# EAGLE design pico_tracker_v3.2 (EAGLE 6.4)
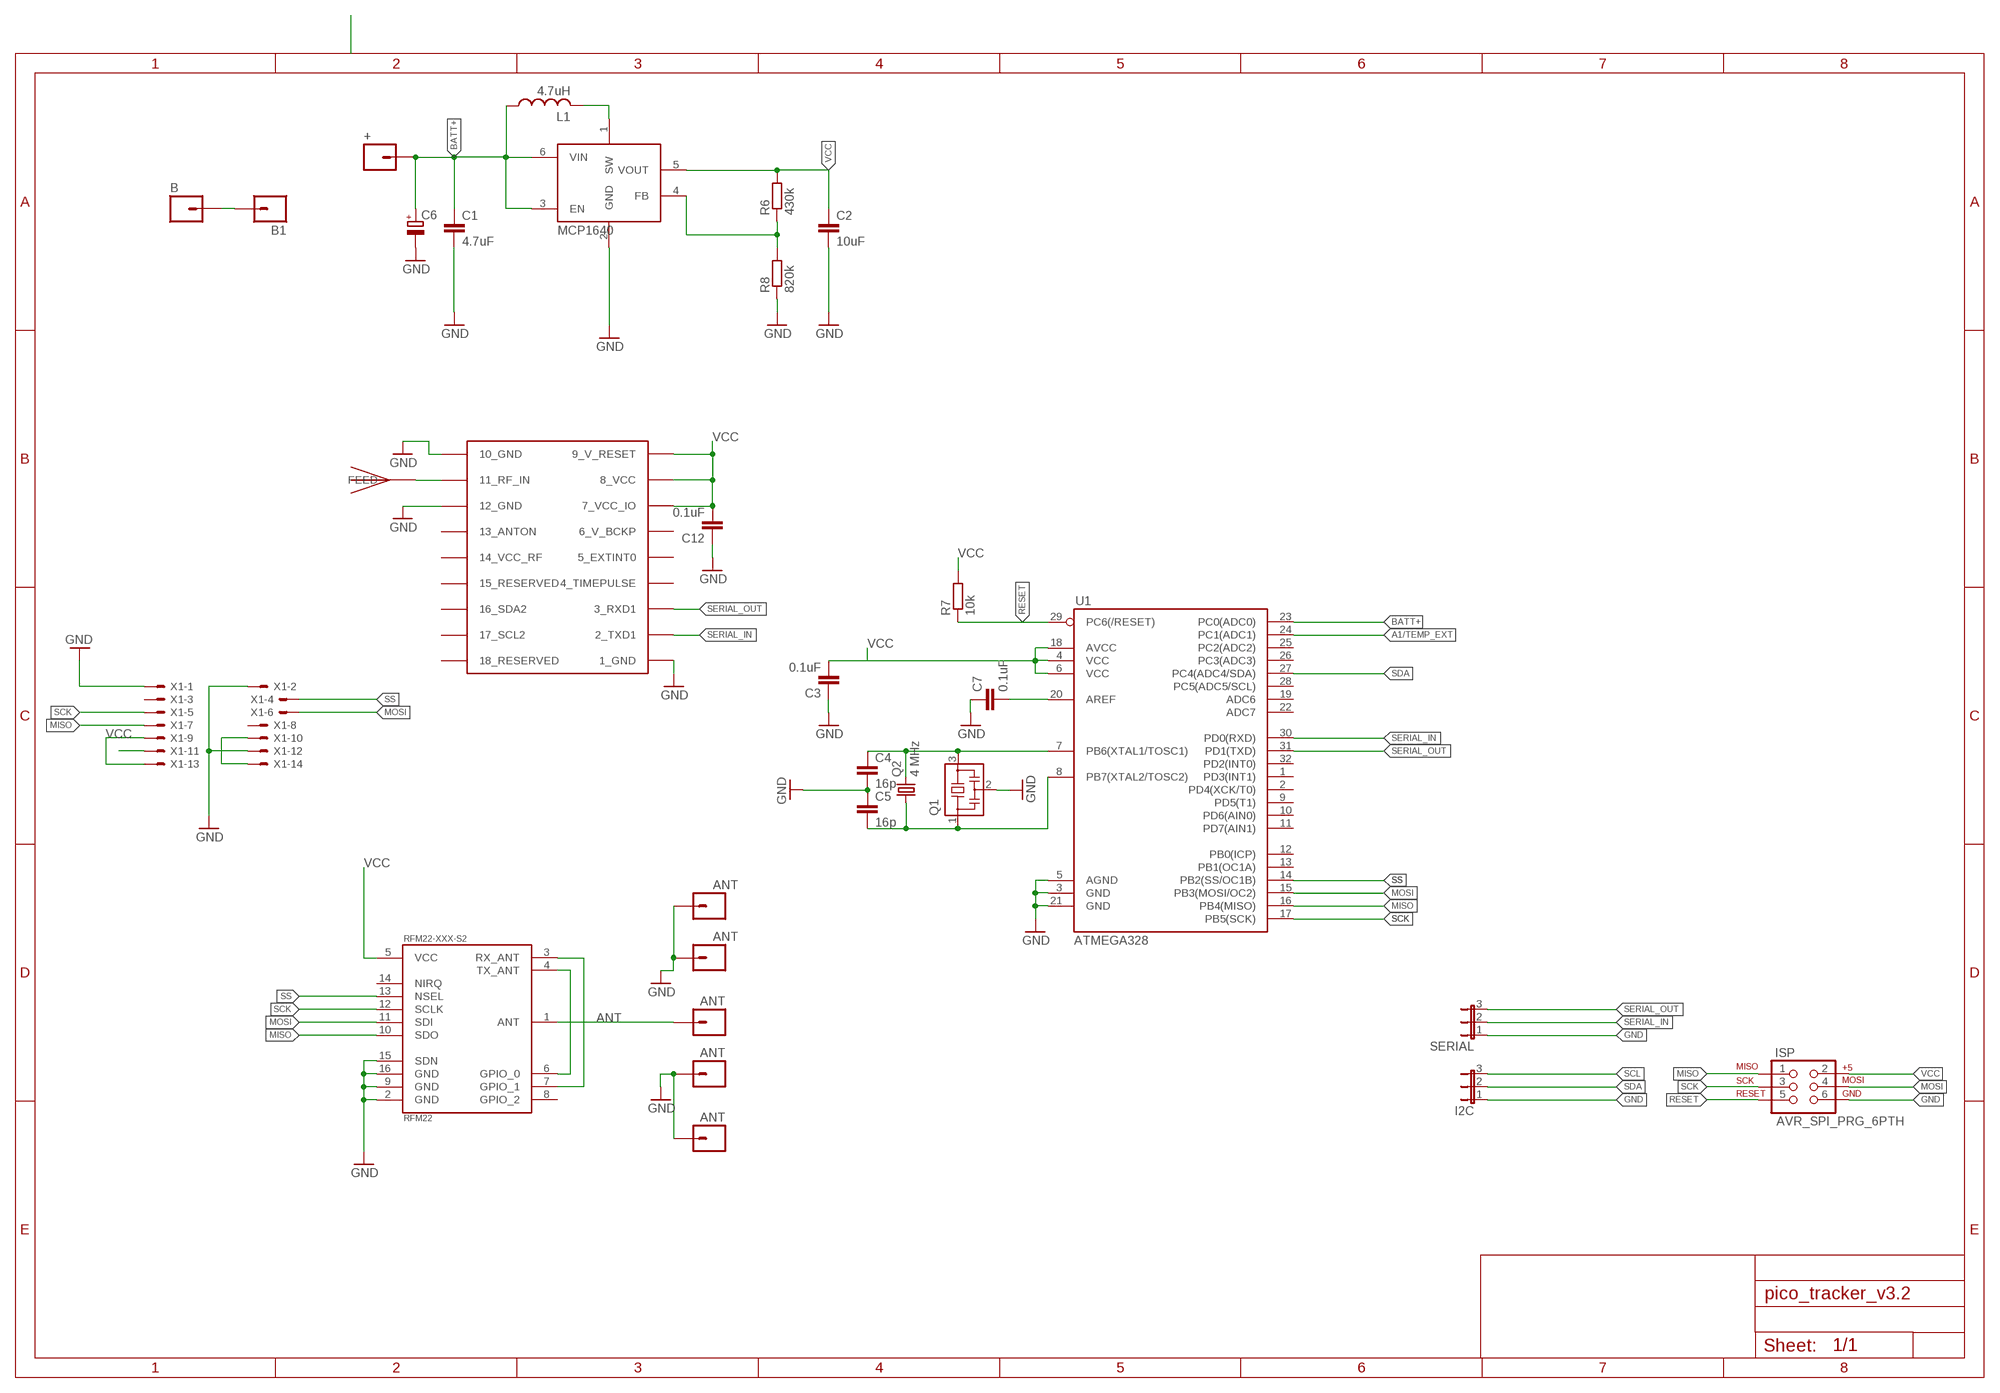
[diagram p0: schematic, sheet 1]

## Parts
+  M01PTH  [1X01]
B  M01PTH  [1X01]
B1  M01PTH  [1X01]
C1  4.7uF  C-EUC0805  [C0805]
C2  10uF  C-EUC0805  [C0805]
C3  0.1uF  C-EUC0603  [C0603]
C4  16p  C-EUC0603  [C0603]
C5  16p  C-EUC0603  [C0603]
C6  CPOL-EUSMCD  [SMC_D]
C7  0.1uF  C-EUC0603  [C0603]
C12  0.1uF  C-EUC0603  [C0603]
GND  ANT  M01PTH  [1X01]
GND17  ANT  M01PTH  [1X01]
GPS_ANT  JTI_ANTENNA-1575AT43A40  [JTI_ANTENNA-1575AT43A40]
I2C  JP2E  [JP2]
ISP  AVR_SPI_PRG_6PTH  [2X3]
JP2  ANT  M01PTH  [1X01]
JP3  ANT  M01PTH  [1X01]
JP4  ANT  M01PTH  [1X01]
L1  4.7uH  LLQH44P_P0  [LQH44]
Q1  CSTCR6M00G53Z  [CSTCR6M]
Q2  4 MHz  ABRACON_ABM3_CRYSTALABM03_HC49  [ABM03_HC49]
R6  430k  R-EU_R0603  [R0603]
R7  10k  R-EU_R0603  [R0603]
R8  820k  R-EU_R0603  [R0603]
RFM22-XXX-S2  RFM22  [RFM22-XXX-S2]
SERIAL  JP2E  [JP2]
U1  ATMEGA328  ATMEGA168  [TQFP32-08]
U2  MCP1640  [SOT23-6]
U$3  UBLOX_MAX-6  [UBLOX_MAX-6]
X1  87758-1416  [87758-1416]

## Nets
A1/TEMP_EXT: U1.24(PC1(ADC1))
ANT: JP2.1 RFM22-XXX-S2.1(ANT)
AREF: C7.2 U1.20(AREF)
BATT+ [vcc]: +.1 C1.1 C6.+ L1.P$1 U1.23(PC0(ADC0)) U2.3(EN) U2.6(VIN)
GND: C1.2 C2.2 C3.1 C4.2 C5.1 C6.- C7.1 C12.1 GND17.1 GND.1 I2C.1 ISP.6 JP3.1 JP4.1 Q1.2 R8.1 RFM22-XXX-S2.2(GND) RFM22-XXX-S2.9(GND) RFM22-XXX-S2.15(SDN) RFM22-XXX-S2.16(GND) SERIAL.1 U1.3(GND) U1.5(AGND) U1.21(GND) U2.2(GND) U$3.1_GND U$3.10_GND U$3.12_GND X1.1 X1.2 X1.12
GPS_ANT: GPS_ANT.FEED U$3.11_RF_IN
MISO: ISP.1 RFM22-XXX-S2.10(SDO) U1.16(PB4(MISO)) X1.7
MOSI: ISP.4 RFM22-XXX-S2.11(SDI) U1.15(PB3(MOSI/OC2)) X1.6
N$1: B1.1 B.1
N$2: X1.9 X1.13
N$3: X1.10 X1.14
N$6: RFM22-XXX-S2.4(TX_ANT) RFM22-XXX-S2.6(GPIO_0)
N$7: RFM22-XXX-S2.3(RX_ANT) RFM22-XXX-S2.7(GPIO_1)
N$8: L1.P$2 U2.1(SW)
N$9: C4.1 Q1.3 Q2.2 U1.7(PB6(XTAL1/TOSC1))
N$10: C5.2 Q1.1 Q2.1 U1.8(PB7(XTAL2/TOSC2))
N$11: R6.1 R8.2 U2.4(FB)
RESET: ISP.5 R7.1 U1.29(PC6(/RESET))
SCK: ISP.3 RFM22-XXX-S2.12(SCLK) U1.17(PB5(SCK)) X1.5
SCL: I2C.3
SDA: I2C.2 U1.27(PC4(ADC4/SDA))
SERIAL_IN: SERIAL.2 U1.30(PD0(RXD)) U$3.2_TXD1
SERIAL_OUT: SERIAL.3 U1.31(PD1(TXD)) U$3.3_RXD1
SS: RFM22-XXX-S2.13(NSEL) U1.14(PB2(SS/OC1B)) X1.4
VCC: C2.1 C3.2 C12.2 ISP.2 R6.2 R7.2 RFM22-XXX-S2.5(VCC) U1.4(VCC) U1.6(VCC) U1.18(AVCC) U2.5(VOUT) U$3.7_VCC_IO U$3.8_VCC U$3.9_V_RESET X1.11
Unconnected: RFM22-XXX-S2.8(GPIO_2) RFM22-XXX-S2.14(NIRQ) U1.1(PD3(INT1)) U1.2(PD4(XCK/T0)) U1.9(PD5(T1)) U1.10(PD6(AIN0)) U1.11(PD7(AIN1)) U1.12(PB0(ICP)) U1.13(PB1(OC1A)) U1.19(ADC6) U1.22(ADC7) U1.25(PC2(ADC2)) U1.26(PC3(ADC3)) U1.28(PC5(ADC5/SCL)) U1.32(PD2(INT0)) U$3.4_TIMEPULSE U$3.5_EXTINT0 U$3.6_V_BCKP U$3.13_ANTON U$3.14_VCC_RF U$3.15_RESERVED U$3.16_SDA2 U$3.17_SCL2 U$3.18_RESERVED X1.3 X1.8

## Library data of the parts
+ B B1 = #sparkfun:M01: Header 1 Standard 1-pin 0.1" header. Use with straight break away headers (SKU : PRT-00116), right angle break away headers (PRT-00553), swiss pins (PRT-00743), machine pins (PRT-00117), and female headers (PRT-00115).
C1-C5 C7 C12 = resistor:C-EU: CAPACITOR, European symbol
C6 = rcl:CPOL-EU: POLARIZED CAPACITOR, European symbol
GND GND17 JP2-JP4 = SparkFun:M01: Header 1 Standard 1-pin 0.1" header. Use with straight break away headers (SKU : PRT-00116), right angle break away headers (PRT-00553), swiss pins (PRT-00743), machine pins (PRT-00117), and female headers (PRT-00115).
GPS_ANT = ava:JTI_ANTENNA-1575AT43A40
I2C SERIAL = jumper:JP2E: JUMPER
ISP = SparkFun:AVR_SPI_PRG_6: AVR ISP 6 Pin This is the reduced ISP connector for AVR programming. Common on Arduino. This footprint will take up less PCB space and can be used with a 10-pin to 6-pin adapter such as SKU: BOB-08508
L1 = karlnet-parts:L
Q1 = murata-filter:CSTCR: Resonator Source: murata.co.jp; MPN: CSTCR6M00G53-R0; OC_FARNELL: 1170434; OC_NEWARK: 25M8759
Q2 = ava:ABRACON_ABM3_CRYSTAL
R6-R8 = resistor:R-EU_: RESISTOR, European symbol
RFM22-XXX-S2 = SparkFun:RFM22: *Hope RF's RFM22* Packages: RFM22-S2 (SMD)
U1 = SparkFun:ATMEGA168
U2 = karlnet-parts:MCP1640: MCP1623, 1624, 1640/B/C/D pwm/pfm or pwm only DC/DC converters, in SOT-23
U$3 = ava:UBLOX_MAX-6: UBLOX MAX-6
X1 = con-molex:87758-1416: 14 Pin - 2mm Dual Row Single Wafer, Vertical T/H HDR Source: http://www.molex.com/pdm_docs/sd/877580616_sd.pdf

## Net classes
0 default: width 0.254 mm, drill 0.508 mm, clearance 0.254 mm
1 vcc: width 0.254 mm

## Board
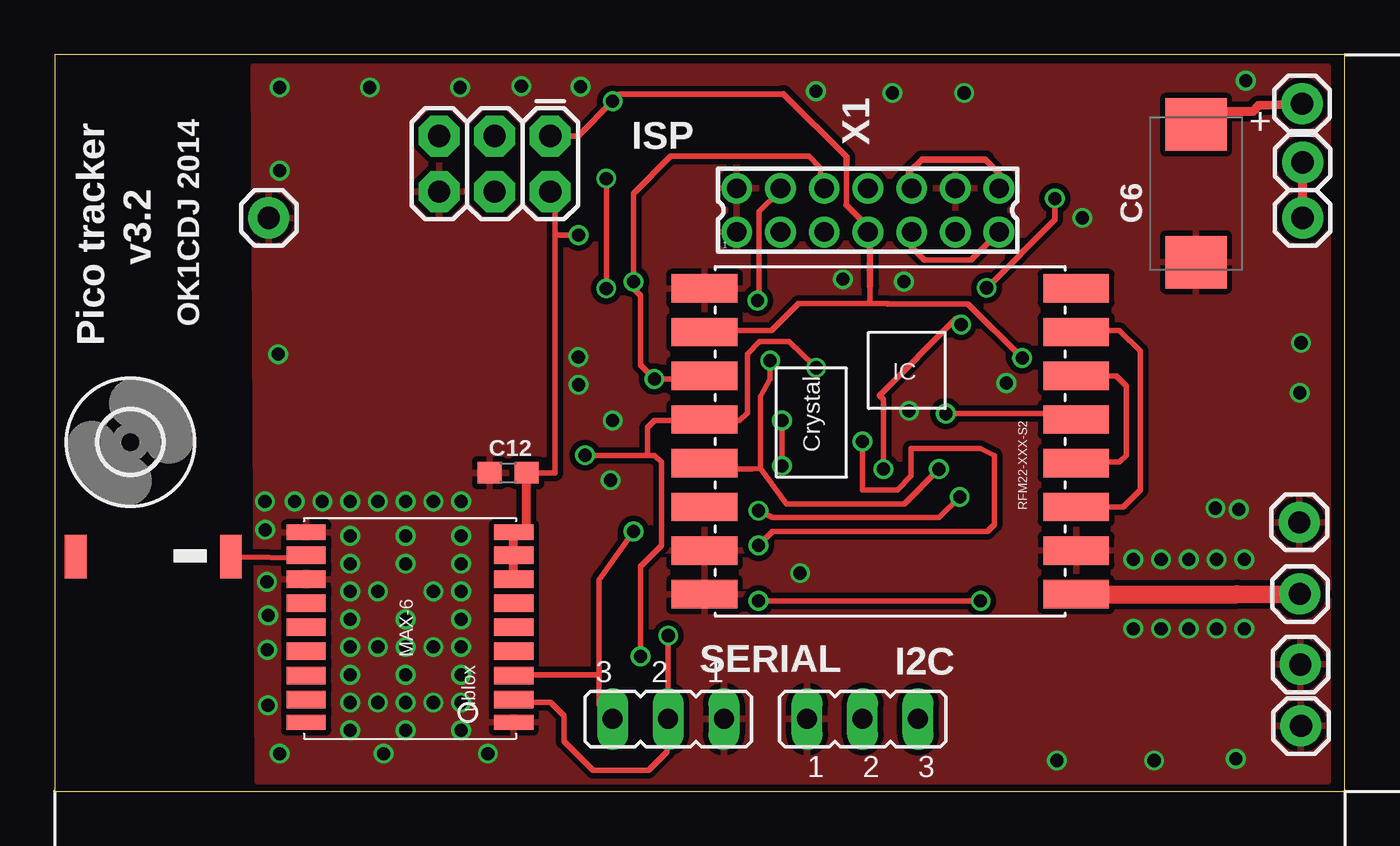
[diagram p1: board, top side]
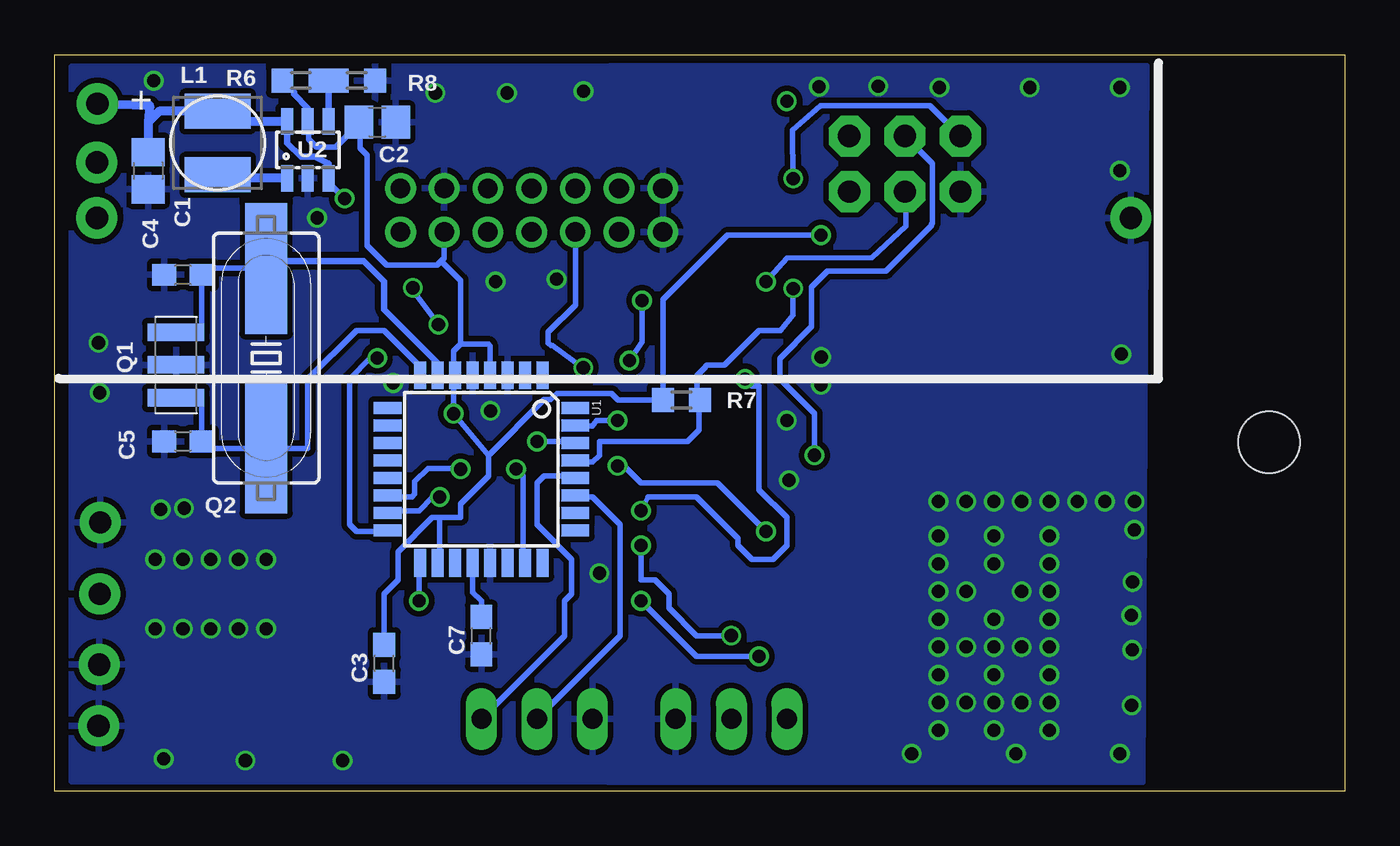
[diagram p2: board, bottom side, seen from below]

Size 59.02 x 33.7 mm. Coordinates in mm from the lower left corner, seen from the top.
Outline: 0,0 59.02,0 59.02,33.7 0,33.7 0,0
Copper layers (1*16): Top 0.035mm / dielectric 1.5mm / Bottom 0.035mm
Design rules "Fusion_eagle_rule_v1.1": minimum track width 6mil, minimum drill 12mil, track to track 6mil, track to pad 6mil, pad to pad 6mil, via to via 6mil, smd to smd 0mil, copper to edge 10mil, drill to drill 10mil, minimum pad ring 10mil, minimum via ring 6mil, stop-mask expansion 2mil, vias tented up to drill 100mil, thermal gap 10mil

### Footprints (pad centres in the part's own frame; a part is rotated, then mirrored left to right if it is on the bottom)
1X01 = drill 1.016 pad 1.88: 1 0,0
C0805 = smd 1.3 x 1.5: 1 -0.85,0; 2 0.85,0
C0603 = smd 1.1 x 1: 1 -0.85,0; 2 0.85,0
SMC_D = smd 2.4 x 2.8: + -3.15,0; - 3.15,0
JTI_ANTENNA-1575AT43A40 = smd 1 x 2: FEED -3.81,-1.27; NC 3.29,-1.27
JP2 = drill 0.914 long: 1 -2.54,0; 2 0,0; 3 2.54,0
2X3 = drill 1.016 pad 1.88 octagon: 1 0,0; 2 0,2.54; 3 2.54,0; 4 2.54,2.54; 5 5.08,0; 6 5.08,2.54
LQH44 = smd 1.6 x 3: P$1 -1.45,0; P$2 1.45,0
CSTCR6M = smd 0.8 x 2.6: 1 -1.5,0; 2 0,0; 3 1.5,0
ABM03_HC49 = smd 6 x 1.93: 1 -4.1,0; 2 4.1,0
R0603 = smd 1 x 1.1: 1 -0.85,0; 2 0.85,0
RFM22-XXX-S2 = smd 3 x 1.3: 1 -8.5,7; 2 -8.5,5; 3 -8.5,3; 4 -8.5,1; 5 -8.5,-1; 6 -8.5,-3; 7 -8.5,-5; 8 -8.5,-7; 9 8.5,-7; 10 8.5,-5; 11 8.5,-3; 12 8.5,-1; 13 8.5,1; 14 8.5,3; 15 8.5,5; 16 8.5,7
TQFP32-08 = smd 1.27 x 0.559: 1 -4.293,2.8; 2 -4.293,2; 3 -4.293,1.2; 4 -4.293,0.4; 5 -4.293,-0.4; 6 -4.293,-1.2; 7 -4.293,-2; 8 -4.293,-2.8; 17 4.293,-2.8; 18 4.293,-2; 19 4.293,-1.2; 20 4.293,-0.4; 21 4.293,0.4; 22 4.293,1.2; 23 4.293,2; 24 4.293,2.8 | smd 0.559 x 1.27: 9 -2.8,-4.293; 10 -2,-4.293; 11 -1.2,-4.293; 12 -0.4,-4.293; 13 0.4,-4.293; 14 1.2,-4.293; 15 2,-4.293; 16 2.8,-4.293; 25 2.8,4.293; 26 2,4.293; 27 1.2,4.293; 28 0.4,4.293; 29 -0.4,4.293; 30 -1.2,4.293; 31 -2,4.293; 32 -2.8,4.293
SOT23-6 = smd 0.55 x 1.2: 1 -0.95,-1.3; 2 0,-1.3; 3 0.95,-1.3; 4 0.95,1.3; 5 0,1.3; 6 -0.95,1.3
2,8 = hole 2.8: 0,0
UBLOX_MAX-6 = smd 1.8 x 0.7: 1_GND 4.95,-4.4; 9_V_RESET 4.95,4.3; 10_GND -4.55,4.3; 18_RESERVED -4.55,-4.4 | smd 1.8 x 0.8: 2_TXD1 4.95,-3.35; 3_RXD1 4.95,-2.25; 4_TIMEPULSE 4.95,-1.15; 5_EXTINT0 4.95,-0.05; 6_V_BCKP 4.95,1.05; 7_VCC_IO 4.95,2.15; 8_VCC 4.95,3.25; 11_RF_IN -4.55,3.25; 12_GND -4.55,2.15; 13_ANTON -4.55,1.05; 14_VCC_RF -4.55,-0.05; 15_RESERVED -4.55,-1.15; 16_SDA2 -4.55,-2.25; 17_SCL2 -4.55,-3.35
87758-1416 = drill 0.9 pad 1.27: 1 -6,-1; 2 -6,1; 3 -4,-1; 4 -4,1; 5 -2,-1; 6 -2,1; 7 0,-1; 8 0,1; 9 2,-1; 10 2,1; 11 4,-1; 12 4,1; 13 6,-1; 14 6,1

### Placement (x,y rotation side)
+  57.06,31.46 0 top
B  57.09,28.77 0 top
B1  57.09,26.23 0 top
C1  54.74,28.38 270 bottom
C2  44.26,30.61 0 bottom
C3  43.94,5.84 90 bottom
C4  53.15,23.62 180 bottom
C5  53.15,16 0 bottom
C6  52.21,27.34 270 top
C7  39.5,7.11 90 bottom
C12  20.74,14.57 0 top
GND  56.98,5.79 0 top
GND17  9.79,26.23 0 top
GPS_ANT  4.25,9.45 180 top
I2C  36.96,3.3 0 top
ISP  22.67,29.97 180 top
JP2  56.96,9.02 0 top
JP3  56.93,12.29 0 top
JP4  57.01,2.98 0 top
L1  51.56,29.65 270 bottom
Q1  53.47,19.49 90 bottom
Q2  49.34,19.81 90 bottom
R6  47.75,32.51 180 bottom
R7  30.34,17.89 180 bottom
R8  45.21,32.51 180 bottom
RFM22-XXX-S2  38.23,16 180 top
SERIAL  28.07,3.3 180 top
U1  39.5,14.73 270 bottom
U2  47.43,29.34 0 bottom
U$1  [2,8]  3.47,15.96 0 top
U$3  16.05,7.54 0 top
X1  37.2,26.58 0 top

### Tracks (layer width: path | path; a pad name or v marks a point on that pad's centre or on a via)
ANT
  Top 0.813: RFM22-XXX-S2.1 54.09,9 JP2.1
AREF
  Bottom 0.254: U1.20 39.9,9.1 39.5,8.7 C7.2
BATT+  (via drill 0.6, 0.6 pad 0.25)
  Top 0.254: v37.91,14.73 37.91,17.91 37.74,18.1 41.24,21.63 v41.47,21.35 | v45.76,27.11 45.76,26.15 v42.63,23.03
  Top 0.406: C6.+ 52.31,30.49 52.92,31.1 54.82,31.1 55.08,31.38 +.1
  Bottom 0.254: v37.91,14.73 37.59,14.41 37.59,10.6 U1.23 | U2.3 46.48,27.84 v45.76,27.11 | v42.63,23.03 42.63,22.92 v41.47,21.35
  Bottom 0.305: U2.3 46.48,28.7 47.12,29.02 47.75,29.02 48.39,29.65 U2.6
  Bottom 0.406: U2.6 51.09,30.64 L1.P$1 54.24,31.1 54.74,30.61 | 54.74,30.61 C1.1 | +.1 54.67,31.38 54.74,30.61
GND  (via drill 0.6, 0.6 pad 0.25)
  other vias: 13.51,11.67 9.62,13.25 9.63,11.96 13.51,10.4 13.51,9.13 13.51,7.86 13.51,6.59 13.51,5.32 13.51,4.05 16.05,2.78 18.59,2.78 14.78,4.05 14.78,6.59 14.78,9.13 16.05,4.05 16.05,5.32 16.05,6.59 16.05,7.86 16.05,10.4 16.05,11.67 17.32,4.05 18.59,4.05 17.32,6.59 17.32,9.13 18.59,5.32 18.59,6.59 18.59,7.86 18.59,9.13 18.59,10.4 18.59,11.67 9.71,9.58 9.76,8.05 10.22,19.99 10.97,13.26 12.24,13.26 13.51,13.26 14.78,13.26 16.05,13.26 17.32,13.26 18.59,13.26 39.08,17.4 23.96,18.59 49.34,10.6 50.61,10.6 51.88,10.6 49.34,7.43 50.61,7.43 51.88,7.43 21.35,32.26 53.15,10.6 53.15,7.43 54.42,10.6 54.42,7.43 13.51,2.78 34.1,9.97 24.05,32.23 36.06,23.42 38.85,23.32 34.82,32.02 38.33,31.94 41.61,31.94 10.29,32.19 10.29,28.38 14.41,32.19 18.54,32.19 54.03,1.47 54.48,32.5 9.75,3.92 9.73,6.46 10.29,1.71 15.05,1.71 19.81,1.71 50.29,1.4 45.85,1.4 25.53,16.95 25.43,14.22 43.53,18.67 53.1,12.94 57.01,20.51 56.96,18.22 54.17,12.89 47.02,26.23 23.95,19.86
  pour Bottom: 9.08,33.18 58.23,33.15 58.23,0.44 9.27,0.41
  pour Top: 9.1,33.17 58.23,33.15 58.23,0.44 9.29,0.43
GPS_ANT
  Top 0.254: GPS_ANT.FEED 8.05,10.72 11.65,10.67 U$3.11_RF_IN
MISO  (via drill 0.6, 0.6 pad 0.25)
  Top 0.254: RFM22-XXX-S2.10 29.97,21.08 32.79,21.08 34.02,22.31 37.2,22.31 | 36.21,26.81 36.21,28.69 | 33.34,31.89 32.21,31.89 32.19,31.88 25.84,31.88 v25.53,31.56 23.94,29.97 ISP.1 | 37.2,22.31 38.09,22.31 38.11,22.29 41.78,22.29 v44.26,19.81 | 37.3,23.1 37.3,22.42 37.2,22.31
  Top 0.305: v44.26,19.81 43.92,19.81 | 37.3,23.1 37.3,25.48 X1.7 37.2,25.82 36.21,26.81 | 36.21,28.69 36.21,29.02 33.34,31.89
  Bottom 0.254: 43.94,11.87 U1.16 43.85,11.87 45.21,11.87 45.53,12.19 45.53,18.86 44.58,19.81 v44.26,19.81
MOSI  (via drill 0.6)
  Top 0.254: RFM22-XXX-S2.11 29.65,18.86 v27.43,18.86 26.8,19.49 26.8,22.67 26.48,22.99 v26.48,23.3 26.48,27.34 28.18,29.04 34.51,29.04 35.04,28.51 35.04,27.74 X1.6 | v32.19,12.83 32.83,12.51 40.45,12.51 v41.4,13.46
  Bottom 0.254: v26.48,23.3 25.53,24.38 21.64,24.41 20.08,25.84 20.08,27.38 ISP.4 | v32.19,12.83 31.88,13.46 29.65,13.46 27.75,11.56 27.75,11.24 27.11,10.6 26.16,10.6 25.53,11.24 25.53,12.51 26.8,13.78 26.8,18.54 27.11,18.54 v27.43,18.86 | v41.4,13.46 41.72,13.46 42.35,12.83 43.62,12.83 U1.15
N$1
  Top 0.406: B1.1 B.1
N$2
  Top 0.254: X1.9 39.2,24.89 39.79,24.3 41.91,24.3 X1.13
N$3
  Top 0.254: 42.58,28.89 43.24,28.23 43.24,27.63 X1.14
  Top 0.305: 42.58,28.89 39.66,28.89 39.08,28.31 39.08,27.7 X1.10
N$6
  Top 0.254: RFM22-XXX-S2.6 48.56,19 49.02,18.54 49.02,15.37 48.7,15.05 47.12,15.05 46.8,14.73 | 46.8,14.73 46.8,15.05 | RFM22-XXX-S2.4 46.73,14.8 46.8,14.73
N$7
  Top 0.254: RFM22-XXX-S2.3 48.88,13 49.66,13.78 49.66,20.13 48.7,21.08 46.8,21.08 | 46.8,21.08 46.8,20.76 46.48,20.76 RFM22-XXX-S2.7 | RFM22-XXX-S2.7 | RFM22-XXX-S2.7 46.8,21.08
N$8
  Bottom 0.406: U2.1 51.59,28.04 51.88,27.75 51.88,27.89 L1.P$2
N$9
  Bottom 0.254: U1.7 | Q2.2 49.34,23.94 51.88,23.94 52.2,23.62 C4.1 52.3,20.99 Q1.3
  Bottom 0.305: U1.7 41.5,19.59 43.94,22.03 43.94,23.3 44.89,24.26 48.99,24.26 Q2.2
N$10
  Bottom 0.254: U1.8 42.3,19.44 43.94,21.08 45.21,21.08 47.43,18.86 47.43,15.68 49.34,15.68 | 49.34,15.68 51.98,15.68 C5.2 52.3,17.99 Q1.1 | Q2.1 49.34,15.68
N$11
  Bottom 0.254: R6.1 R8.2
  Bottom 0.305: U2.4 46.48,32.09 R8.2
RESET  (via drill 0.6)
  Top 0.254: v25.23,23 v25.23,28.03
  Bottom 0.254: U1.29 35.05,15.05 34.42,15.05 34.1,15.37 34.1,16 30.07,16 29.55,16.52 29.55,17.83 R7.1 29.63,18.03 29.63,19.01 29.25,19.39 29.25,19.42 29.17,19.49 28.38,19.49 26.8,21.08 25.81,21.08 25.23,21.78 v25.23,23 | 17.58,29.96 ISP.5 18.97,31.36 23.99,31.36 25.26,30.24 v25.23,28.03
SCK  (via drill 0.6, 0.6 pad 0.25)
  Top 0.254: v32.19,8.7 v42.35,8.7 | v26.8,6.16 26.8,10.29 27.75,11.24 27.75,15.05 27.43,15.37 27.11,15.37 | 27.11,15.37 v24.26,15.37 | 27.11,15.37 27.11,16.64 27.43,16.95 29.65,16.95 RFM22-XXX-S2.12 30.61,17.27 30.92,16.95 31.33,16.95 31.69,17.31 31.69,20 32.25,20.56 33.59,20.56 34.71,19.49 v34.84,19.37
  Bottom 0.254: v42.35,8.7 42.35,10.29 U1.17 | v26.8,6.16 29.65,6.16 v32.19,8.7 | v24.26,15.37 24.26,17.27 25.84,18.86 25.84,19.8 24.4,21.25 24.4,23.05 23.66,23.79 20.99,23.79 18.91,25.87 18.91,25.95 18.86,26 18.86,28.7 ISP.3 | X1.5 35.2,22.23 36.44,20.99 36.44,20.51 36.31,20.38 36.23,20.38 v34.84,19.37
SCL
  Bottom 0.254: 35.37,14.41 36.64,14.41 36.96,14.1 36.96,12.19 35.37,10.6 35.37,9.02 35.69,8.7 35.69,7.11 I2C.3
SDA
  Bottom 0.254: I2C.2 33.15,7.11 33.15,12.19 34.42,13.46 35.69,13.46 U1.27
SERIAL_IN  (via drill 0.6 pad 0.25)
  Top 0.254: v28.07,7.11 SERIAL.2 28,3.24 28,1.79 27.17,0.95 24.63,0.95 23.3,2.27 23.3,3.44 22.69,4.05 21.13,4.05 U$3.2_TXD1 | v32.19,11.24 32.83,11.87 42.67,11.87 42.99,12.19 42.99,15.37 42.35,15.68 39.18,15.68 39.18,14.41 38.54,13.78 36.96,13.78 v36.96,16
  Bottom 0.254: v36.96,16 35.37,16 U1.30 | v28.07,7.11 29.65,7.11 30.92,8.38 30.92,9.02 31.56,9.65 32.19,9.65 v32.19,11.24
SERIAL_OUT  (via drill 0.6 pad 0.25)
  Top 0.254: v26.48,11.87 24.89,9.65 24.89,5.32 | U$3.3_RXD1 21.13,5.32 24.89,5.32 | 24.89,5.32 24.89,3.94 SERIAL.3 | v33.27,14.88 v33.27,16.95
  Bottom 0.254: v26.48,11.87 28.7,14.1 32.19,14.1 33.15,15.05 v33.27,14.88 | v33.27,16.95 34.24,16.95 34.42,16.7 35.17,16.7 U1.31
SS  (via drill 0.6, 0.61)
  Top 0.254: RFM22-XXX-S2.13 30.61,14.73 31.88,14.73 32.3,14.77 | v40.45,14.73 38.86,13.14 33.46,13.14 32.3,14.77 | 33.08,27.75 33.2,27.63 X1.4 33.2,27.48 32.22,26.5 32.22,22.52 v32.14,22.44 | v32.73,19.7 32.73,18.86 32.3,18.05 32.3,14.77
  Bottom 0.254: U1.14 43.31,13.46 42.67,13.46 42.55,13.59 42.55,14.16 41.94,14.76 40.48,14.76 v40.45,14.73 | v32.14,22.44 32.14,20.54 v32.73,19.7
VCC  (via drill 0.6, 0.61)
  Top 0.254: v40.77,17.27 45.85,17.27 RFM22-XXX-S2.5 | C12.2 22.9,14.57 22.9,16.09 22.88,25.54 | 22.88,25.54 22.88,27.22 ISP.2 | v23.96,25.44 22.99,25.44 22.88,25.54
  Top 0.406: C12.2 21.59,11.84 U$3.9_V_RESET U$3.8_VCC U$3.7_VCC_IO
  Bottom 0.254: 39.18,15.37 v40.77,17.27 40.77,18.54 U1.6 40.77,19.09 40.77,20.13 40.45,20.45 | U1.4 39.1,20.36 39.18,20.45 40.45,20.45 | 41.4,10.29 U1.18 41.4,10.6 41.4,12.51 | C3.2 43.94,9.02 43.31,9.65 43.31,10.95 41.75,12.51 41.4,12.51 | 39.18,15.37 36.64,17.91 36.32,17.91 36.03,18.2 33.54,18.2 33.24,17.89 R7.2 31.19,22.48 28.23,25.44 v23.96,25.44 | 39.18,15.37 39.18,14.41 40.45,13.14 40.45,12.51 41.4,12.51 | X1.11 41.2,24.38 41.34,24.24 | 41.34,24.24 41.52,24.07 43.83,24.07 44.72,24.96 44.72,29.1 45.05,29.43 45.05,30.54 C2.1 45.11,30.51 46.16,29.45 47.03,29.45 47.41,29.83 47.41,30.61 U2.5 | 40.45,20.45 40.45,23.36 41.34,24.24
  Bottom 0.305: U2.5 47.43,31.24 48.07,31.88 48.07,31.98 R6.2

### Text on the board
tPlace: v3.2 | Pico tracker
tNames: OK1CDJ 2014 | +